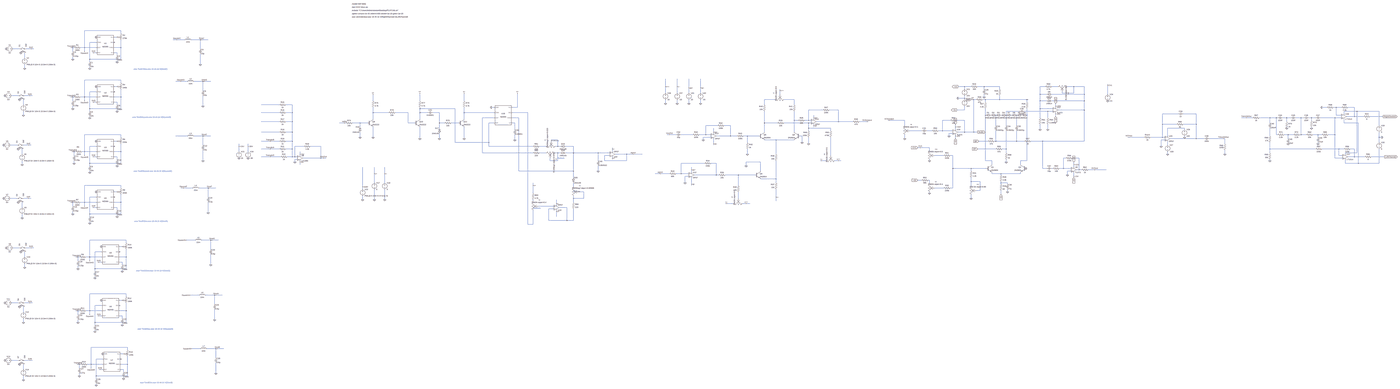
[diagram p0: schematic Test Case 2-Chord.asc, whole sheet]
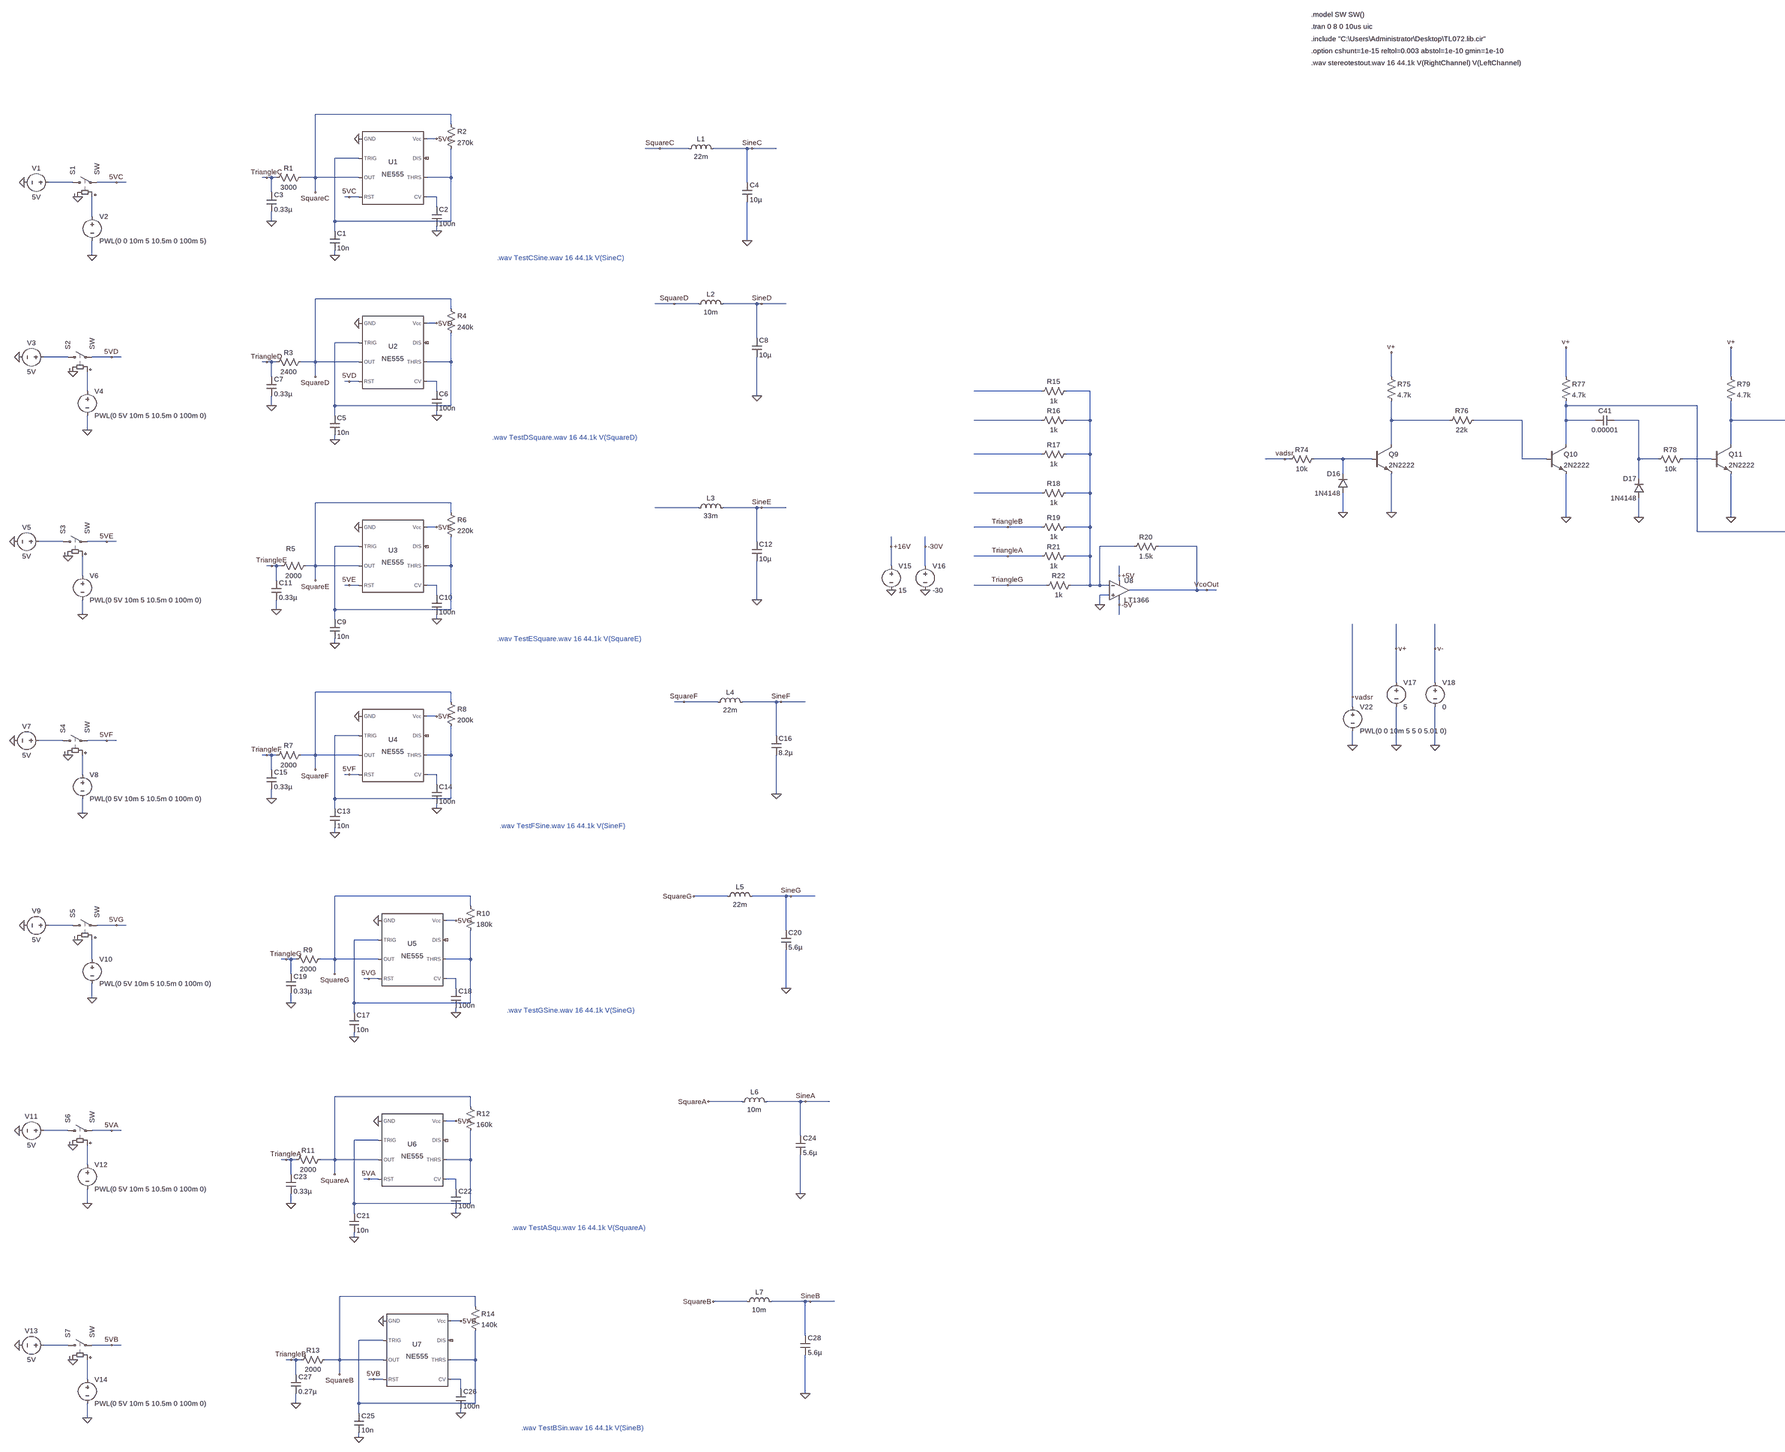
[diagram p1: schematic Test Case 2-Chord.asc, part, row 1 of 1, column 1 of 3]
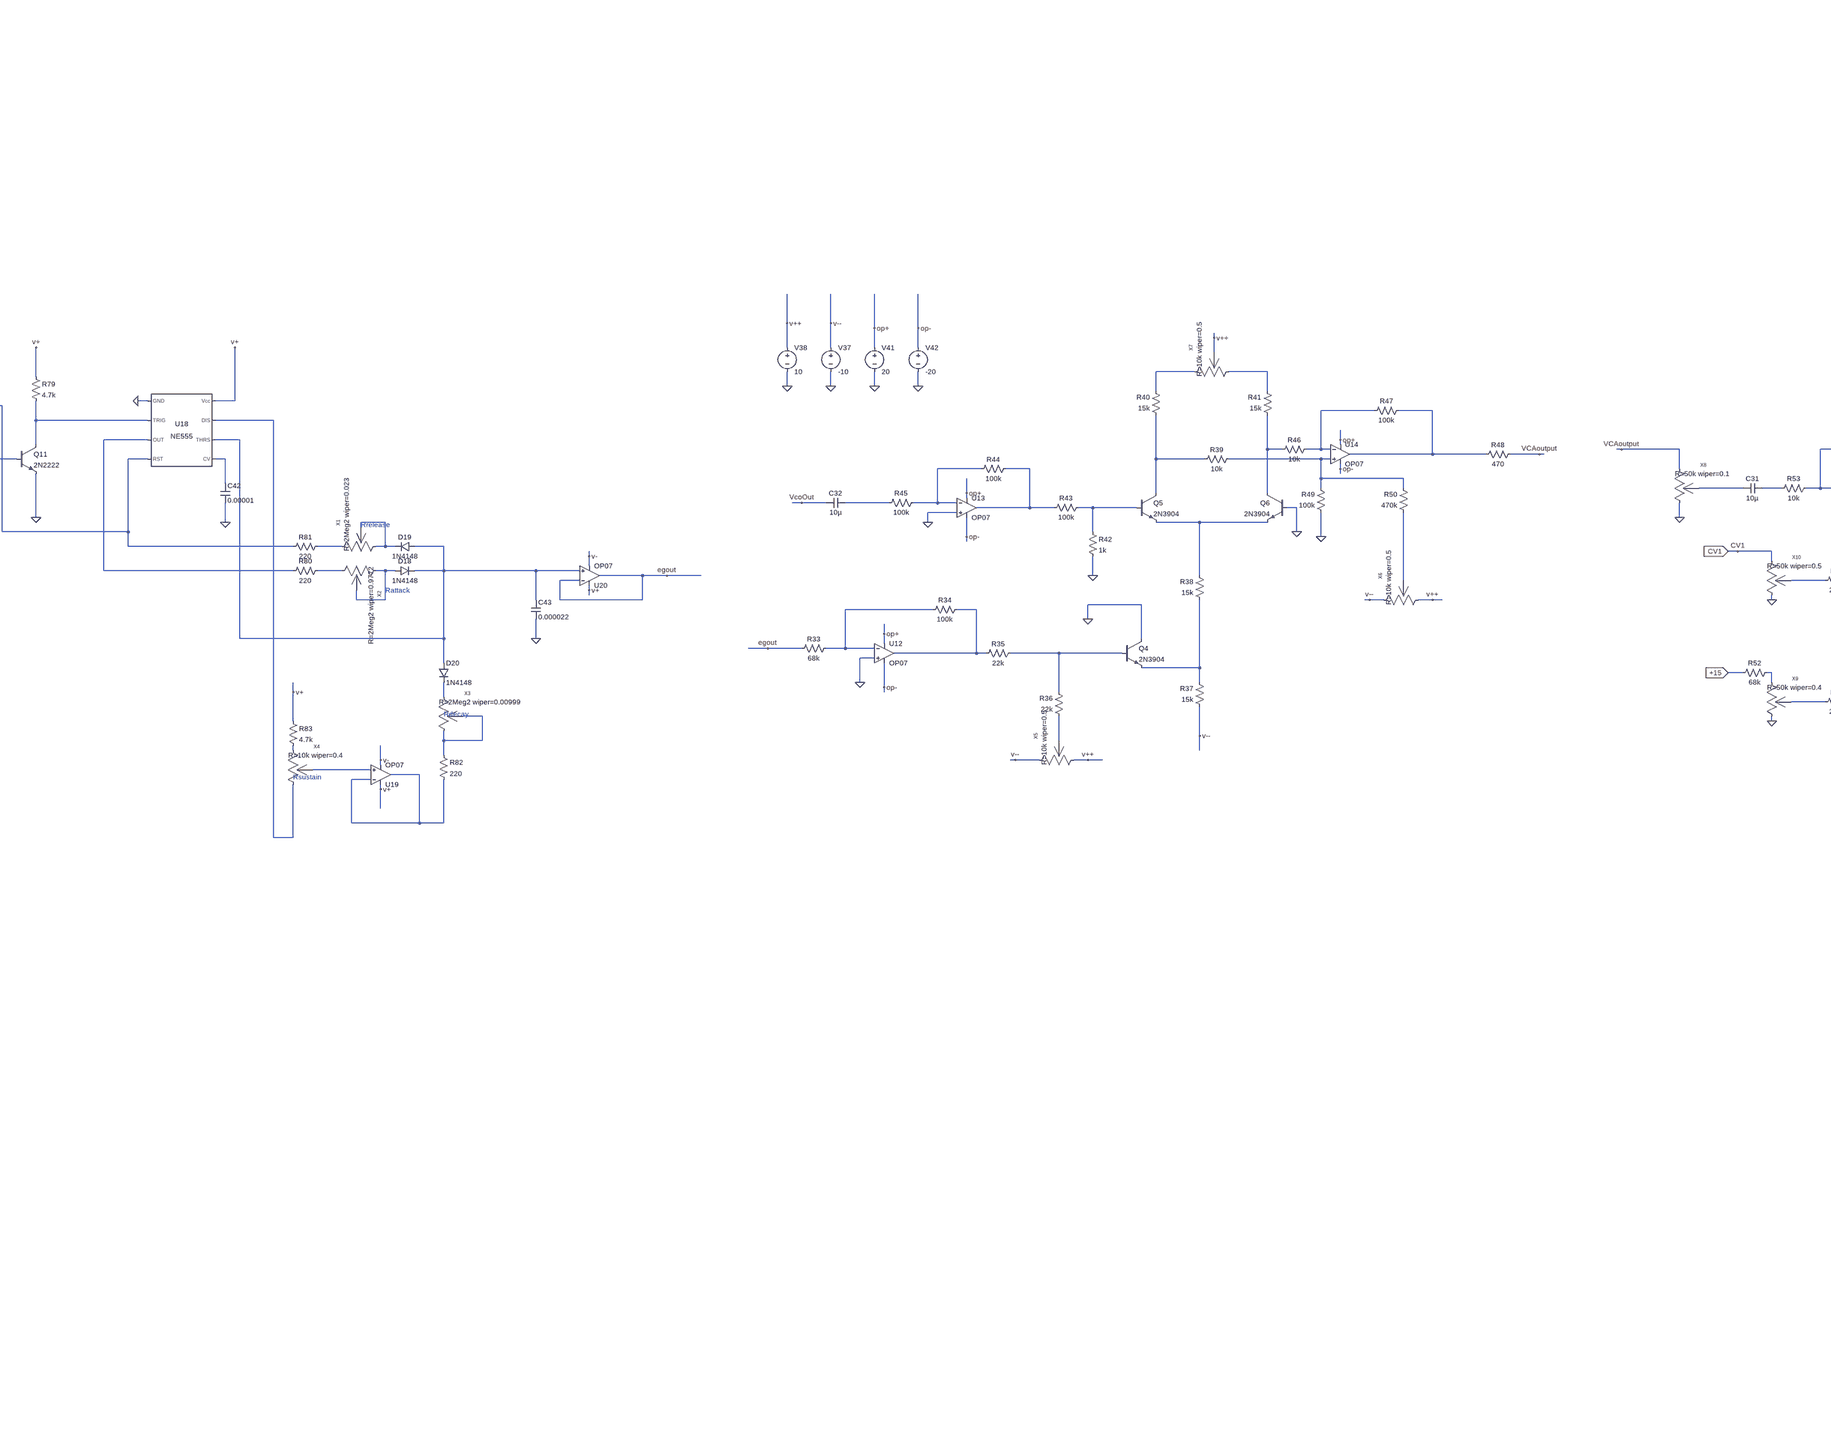
[diagram p2: schematic Test Case 2-Chord.asc, part, row 1 of 1, column 2 of 3]
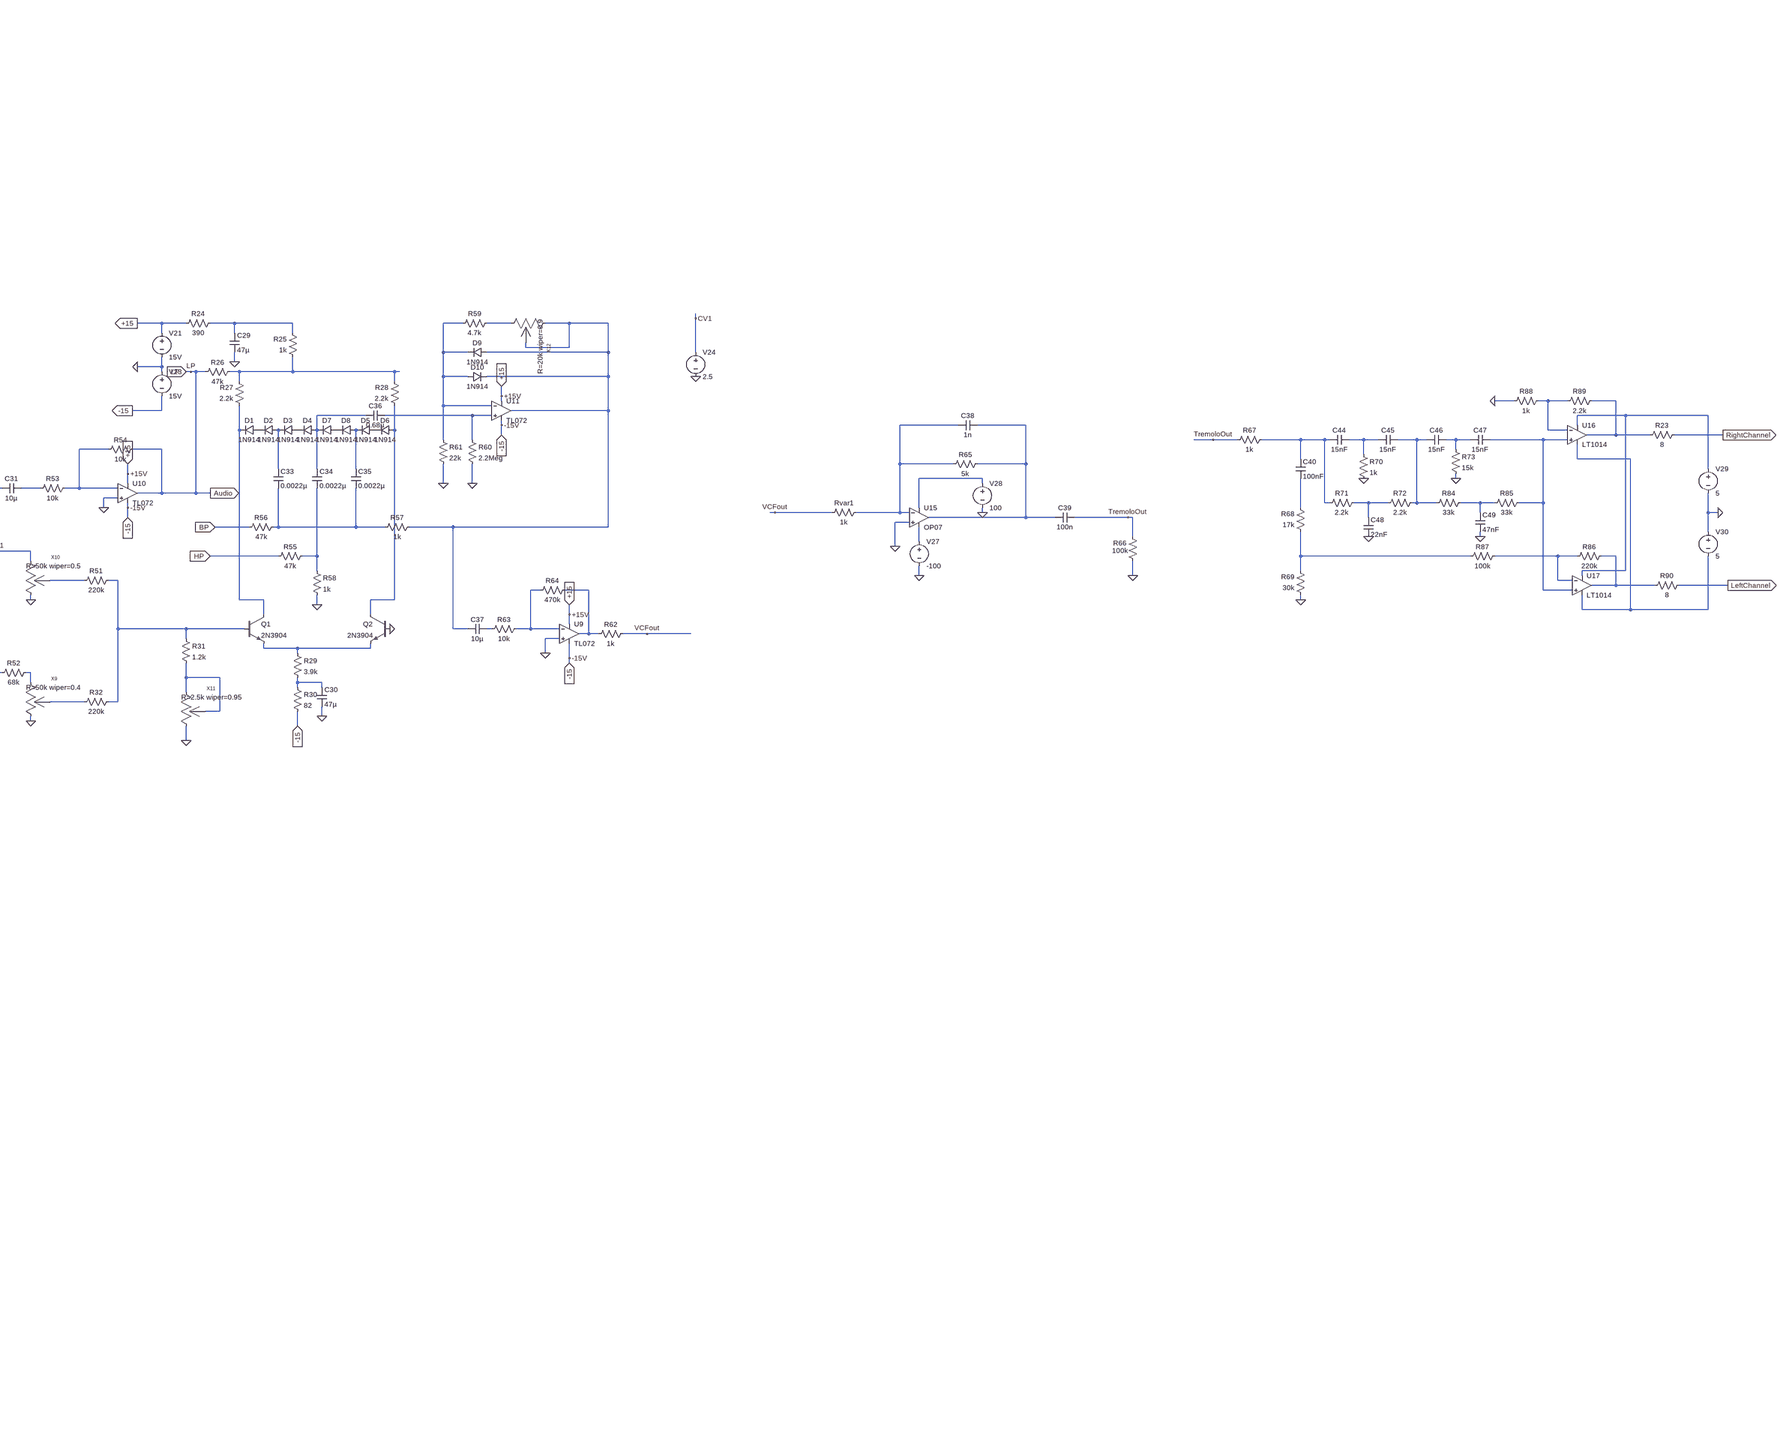
[diagram p3: schematic Test Case 2-Chord.asc, part, row 1 of 1, column 3 of 3]
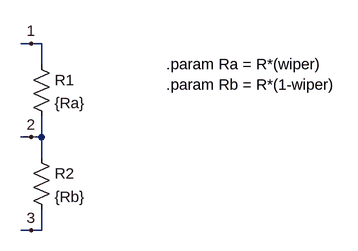
[diagram p4: sub-circuit varres.asc]
* Test Case 2-Chord.asc
V17 v+ 0 5
V18 v- 0 0
V22 vadsr 0 PWL(0 0 10m 5 5 0 5.01 0)
XU12 0 N086 op+ op- N087 LT1001  ; OP07, pins In+ In- V+ V- OUT
XU13 0 N052 op+ op- N053 LT1001  ; OP07, pins In+ In- V+ V- OUT
XU14 N050 N021 op+ op- N022 LT1001  ; OP07, pins In+ In- V+ V- OUT
R33 N086 egout 68k
R34 N087 N086 100k
R35 N090 N087 22k
R36 N100 N090 22k
R37 v-- N091 15k
R38 N091 N067 15k
Q4 0 N090 N091 0 2N3904
Q5 N049 N064 N067 0 2N3904
Q6 N043 0 N067 0 2N3904
R39 N050 N049 10k
R40 N049 N011 15k
R41 N043 N012 15k
R42 N064 0 1k
R43 N064 N053 100k
R44 N053 N052 100k
R45 N052 N060 100k
C32 N060 VcoOut 10µ
R46 N021 N043 10k
R47 N022 N021 100k
R48 VCAoutput N022 470
R49 0 N050 100k
R50 N080 N050 470k
V37 v-- 0 -10
V38 v++ 0 10
XU1 0 N001 SquareC 5VC N003 N001 NC_01 5VC NE555  ; pins GND TRIG OUT RST CV THRS DIS Vcc
C1 N001 0 10n
R1 SquareC TriangleC 3000
C2 N003 0 100n
R2 SquareC N001 270k
C3 TriangleC 0 0.33µ
V1 N002 0 5V
L1 SquareC SineC 22m
C4 SineC 0 10µ
XU2 0 N009 SquareD 5VD N014 N009 NC_02 5VD NE555  ; pins GND TRIG OUT RST CV THRS DIS Vcc
C5 N009 0 10n
R3 SquareD TriangleD 2400
C6 N014 0 100n
R4 SquareD N009 240k
C7 TriangleD 0 0.33µ
L2 SquareD SineD 10m
C8 SineD 0 10µ
XU3 0 N071 SquareE 5VE N083 N071 NC_03 5VE NE555  ; pins GND TRIG OUT RST CV THRS DIS Vcc
C9 N071 0 10n
R5 SquareE TriangleE 2000
C10 N083 0 100n
R6 SquareE N071 220k
C11 TriangleE 0 0.33µ
L3 N063 SineE 33m
C12 SineE 0 10µ
XU4 0 N098 SquareF 5VF N104 N098 NC_04 5VF NE555  ; pins GND TRIG OUT RST CV THRS DIS Vcc
C13 N098 0 10n
R7 SquareF TriangleF 2000
C14 N104 0 100n
R8 SquareF N098 200k
C15 TriangleF 0 0.33µ
L4 SquareF SineF 22m
C16 SineF 0 8.2µ
XU5 0 N107 SquareG 5VG N109 N107 NC_05 5VG NE555  ; pins GND TRIG OUT RST CV THRS DIS Vcc
C17 N107 0 10n
R9 SquareG TriangleG 2000
C18 N109 0 100n
R10 SquareG N107 180k
C19 TriangleG 0 0.33µ
L5 SquareG SineG 22m
C20 SineG 0 5.6µ
XU6 0 N111 SquareA 5VA N113 N111 NC_06 5VA NE555  ; pins GND TRIG OUT RST CV THRS DIS Vcc
C21 N111 0 10n
R11 SquareA TriangleA 2000
C22 N113 0 100n
R12 SquareA N111 160k
C23 TriangleA 0 0.33µ
L6 SquareA SineA 10m
C24 SineA 0 5.6µ
XU7 0 N114 SquareB 5VB N117 N114 NC_07 5VB NE555  ; pins GND TRIG OUT RST CV THRS DIS Vcc
C25 N114 0 10n
R13 SquareB TriangleB 2000
C26 N117 0 100n
R14 SquareB N114 140k
C27 TriangleB 0 0.27µ
L7 SquareB SineB 10m
C28 SineB 0 5.6µ
S1 N002 5VC N004 0 SW
V2 N004 0 PWL(0 0 10m 5 10.5m 0 100m 5)
V3 N010 0 5V
S2 N010 5VD N015 0 SW
V4 N015 0 PWL(0 5V 10m 5 10.5m 0 100m 0)
V5 N069 0 5V
S3 N069 5VE N079 0 SW
V6 N079 0 PWL(0 5V 10m 5 10.5m 0 100m 0)
V7 N099 0 5V
S4 N099 5VF N103 0 SW
V8 N103 0 PWL(0 5V 10m 5 10.5m 0 100m 0)
V9 N106 0 5V
S5 N106 5VG N108 0 SW
V10 N108 0 PWL(0 5V 10m 5 10.5m 0 100m 0)
V11 N110 0 5V
S6 N110 5VA N112 0 SW
V12 N112 0 PWL(0 5V 10m 5 10.5m 0 100m 0)
V13 N115 0 5V
S7 N115 5VB N116 0 SW
V14 N116 0 PWL(0 5V 10m 5 10.5m 0 100m 0)
XU8 0 N017 +5V -5V VcoOut LT1366  ; pins In+ In- V+ V- OUT
R15 N017 N016 1k
R16 N017 N026 1k
R17 N017 N045 1k
R18 N017 N059 1k
R19 N017 TriangleB 1k
V15 +16V 0 15
V16 -30V 0 -30
R20 VcoOut N017 1.5k
R21 N017 TriangleA 1k
R22 N017 TriangleG 1k
V41 op+ 0 20
V42 op- 0 -20
R74 N046 vadsr 10k
D16 0 N046 1N4148
Q9 N027 N046 0 0 2N2222
R75 v+ N027 4.7k
R76 N028 N027 22k
Q10 N020 N028 0 0 2N2222
R77 v+ N020 4.7k
C41 N029 N020 0.00001
D17 0 N029 1N4148
R78 N047 N029 10k
Q11 N030 N047 0 0 2N2222
R79 v+ N030 4.7k
XU18 0 N030 N036 N020 N048 N037 N031 v+ NE555  ; pins GND TRIG OUT RST CV THRS DIS Vcc
R80 N077 N036 220
D18 N078 N037 1N4148
R81 N072 N020 220
D19 N037 N066 1N4148
D20 N037 N095 1N4148
R82 N097 N105 220
XU19 N102 N105 v+ v- N105 LT1001  ; OP07, pins In+ In- V+ V- OUT
R83 v+ N101 4.7k
C42 N048 0 0.00001
XU20 N037 egout v+ v- egout LT1001  ; OP07, pins In+ In- V+ V- OUT
C43 N037 0 0.000022
XX1 N066 N066 N072 varres params: R=2Meg2 wiper=0.023
XX2 N077 N078 N078 varres params: R=2Meg2 wiper=0.9772
XX3 N097 N097 N095 varres params: R=2Meg2 wiper=0.00999
XX4 N031 N102 N101 varres params: R=10k wiper=0.4
XX5 v++ N100 v-- varres params: R=10k wiper=0.5
XX6 v++ N080 v-- varres params: R=10k wiper=0.5
XX7 N012 v++ N011 varres params: R=10k wiper=0.5
V21 +15V 0 15V
V23 0 -15V 15V
R24 N005 +15V 390
R25 N013 N005 1k
C29 N005 0 47µ
R26 N013 LP 47k
R27 N034 N013 2.2k
R28 N035 N013 2.2k
D1 P001 N034 1N914
D2 N054 P001 1N914
D3 P002 N054 1N914
D4 N023 P002 1N914
D5 P003 N055 1N914
D6 N035 P003 1N914
Q1 N034 N082 N089 0 2N3904
Q2 N035 0 N089 0 2N3904
R29 N089 N094 3.9k
R30 N094 -15V 82
C30 N094 0 47µ
R31 N082 N093 1.2k
R32 N082 N096 220k
R51 N082 N081 220k
R52 N092 +15V 68k
R53 N044 N058 10k
R54 LP N044 10k
C31 N058 N057 10µ
D7 P004 N023 1N914
D8 N055 P004 1N914
R55 N073 HP 47k
R56 N068 BP 47k
C33 N054 N068 0.0022µ
C34 N023 N073 0.0022µ
C35 N055 N068 0.0022µ
R57 N008 N068 1k
C36 N024 N023 0.68µ
R58 N073 0 1k
D9 N008 N006 1N914
D10 N006 N008 1N914
R59 N007 N006 4.7k
R60 N024 0 2.2Meg
R61 N006 0 22k
R62 VCFout N085 1k
C37 N088 N008 10µ
R63 N084 N088 10k
R64 N085 N084 470k
XU9 0 N084 +15V -15V N085 TL072  ; pins In+ In- V+ V- OUT
XU10 0 N044 +15V -15V LP TL072  ; pins In+ In- V+ V- OUT
XU11 N024 N006 +15V -15V N008 TL072  ; pins In+ In- V+ V- OUT
V24 CV1 0 2.5
XX8 0 N057 VCAoutput varres params: R=50k wiper=0.1
XX9 0 N096 N092 varres params: R=50k wiper=0.4
XX10 0 N081 CV1 varres params: R=50k wiper=0.5
XX11 0 N093 N093 varres params: R=2.5k wiper=0.95
XX12 N007 N008 N008 varres params: R=20k wiper=0.9
Rvar1 N032 VCFout 1k
R65 N033 N032 5k
R66 0 TremoloOut 100k
C38 N033 N032 1n
C39 TremoloOut N033 100n
XU15 0 N032 N056 N070 N033 LT1001  ; OP07, pins In+ In- V+ V- OUT
V27 N070 0 -100
V28 N056 0 100
R67 N038 TremoloOut 1k
R68 N074 N065 17k
R69 0 N074 30k
C40 N038 N065 100nF
C44 N039 N038 15nF
C45 N040 N039 15nF
C46 N041 N040 15nF
C47 N042 N041 15nF
R70 N039 0 1k
R71 N061 N038 2.2k
R72 N040 N061 2.2k
C48 N061 0 22nF
R73 N041 0 15k
R84 N062 N040 33k
R85 N042 N062 33k
C49 N062 0 47nF
XU16 N042 N018 N025 N051 N019 LT1014  ; pins In+ In- V+ V- OUT
XU17 N042 N075 N025 N051 N076 LT1014  ; pins In+ In- V+ V- OUT
R86 N076 N075 220k
R87 N075 N074 100k
R88 N018 0 1k
R89 N019 N018 2.2k
V29 N025 0 5
V30 0 N051 5
R23 RightChannel N019 8
R90 LeftChannel N076 8

* block symbol definitions
.subckt varres 3 2 1
R1 1 2 {Ra}
R2 2 3 {Rb}
.param Ra = R*(wiper)
.param Rb = R*(1-wiper)
.ends varres

.model D D
.lib standard.dio
.model NPN NPN
.model PNP PNP
.lib standard.bjt
* .wav TestCSine.wav 16 44.1k V(SineC)
* .wav TestDSquare.wav 16 44.1k V(SquareD)
* .wav TestESquare.wav 16 44.1k V(SquareE)
* .wav TestFSine.wav 16 44.1k V(SineF)
* .wav TestGSine.wav 16 44.1k V(SineG)
* .wav TestASqu.wav 16 44.1k V(SquareA)
* .wav TestBSin.wav 16 44.1k V(SineB)
.model SW SW()
* Rattack
* Rrelease
* Rdecay
* Rsustain
.include "C:\Users\Administrator\Desktop\TL072.lib.cir"
.tran 0 8 0 10us uic
.option cshunt=1e-15 reltol=0.003 abstol=1e-10 gmin=1e-10
.wav stereotestout.wav 16 44.1k V(RightChannel) V(LeftChannel)
.lib LTC.lib
.lib NE555.sub
.backanno
.end